# Altium schematic sheet outputs.SchDoc
size A4
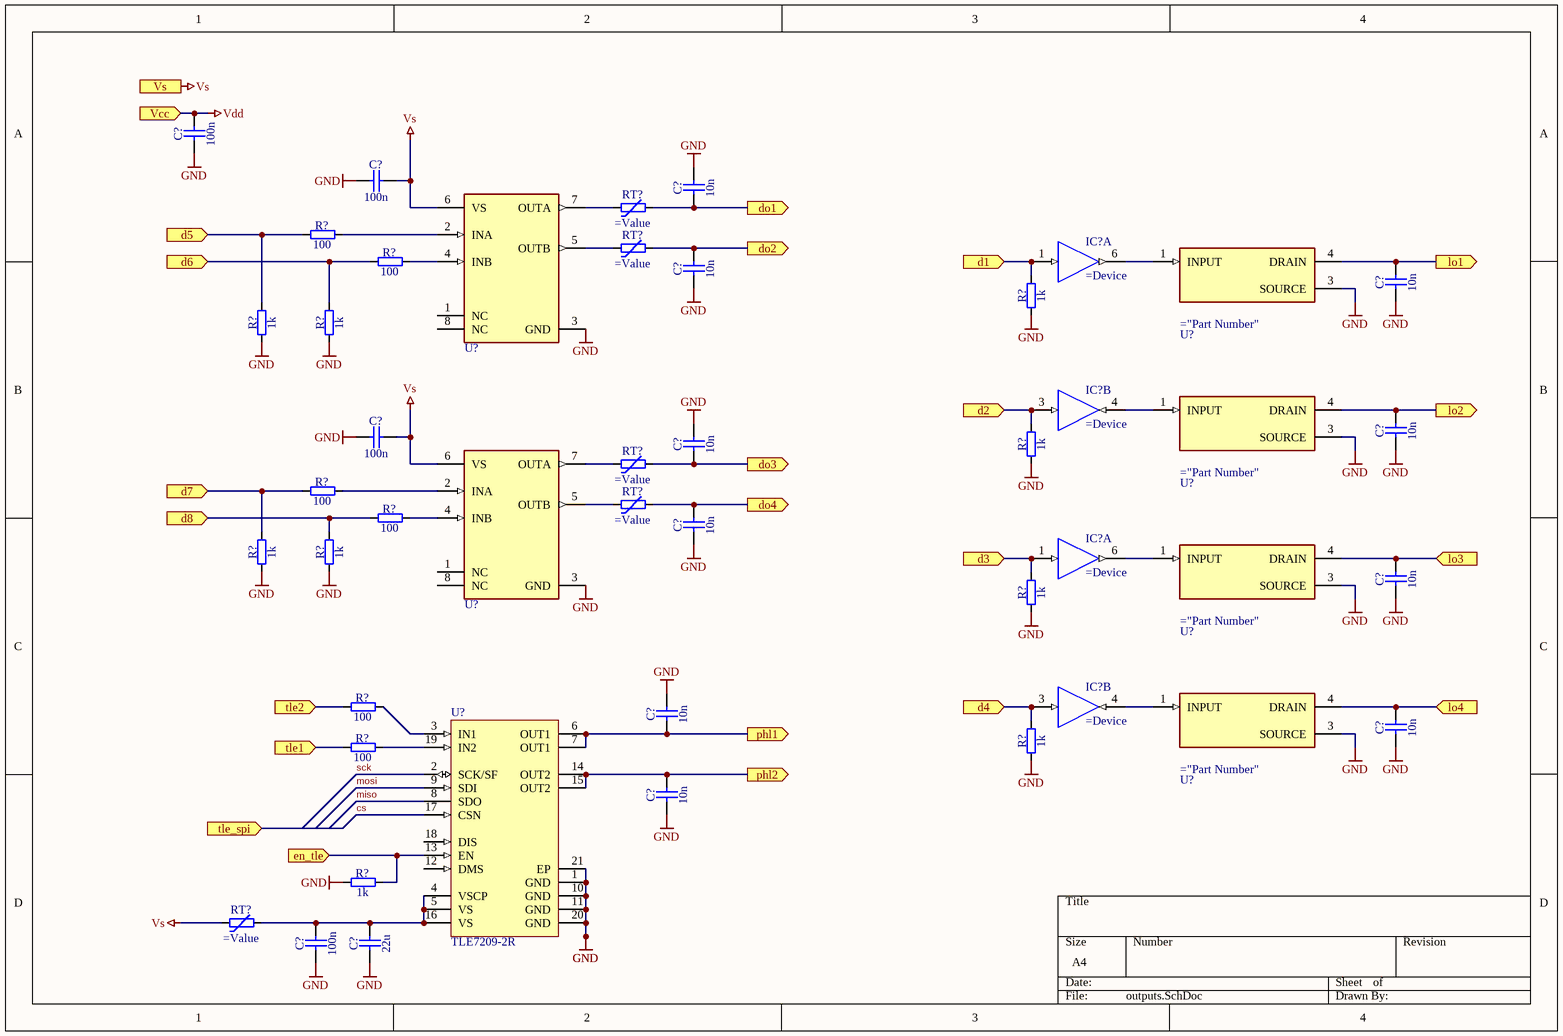
[diagram p0: outputs.SchDoc]

## Parts
(Parts that share a designator on the sheet are numbered #1, #2 ... from top to bottom, then left to right.)
C?#1  100n
C?#2  100n
C?#3  10n
C?#4  10n
C?#5  10n
C?#6  100n
C?#7  10n
C?#8  10n
C?#9  10n
C?#10  10n
C?#11  10n
C?#12  10n
C?#13  10n
C?#14  100n
C?#15  22u
IC?#1  (no value)  (part A of 2)
IC?#2  (no value)  (part B of 2)
IC?#3  (no value)  (part A of 2)
IC?#4  (no value)  (part B of 2)
R?#1  100
R?#2  100
R?#3  1k
R?#4  1k
R?#5  1k
R?#6  1k
R?#7  100
R?#8  100
R?#9  1k
R?#10  1k
R?#11  1k
R?#12  100
R?#13  100
R?#14  1k
R?#15  1k
RT?#1  (no value)
RT?#2  (no value)
RT?#3  (no value)
RT?#4  (no value)
RT?#5  (no value)
U?#1  IR4427STRPBF  (value not drawn)
U?#2  VND7NV04TR-E  (value not drawn)
U?#3  VND7NV04TR-E  (value not drawn)
U?#4  IR4427STRPBF  (value not drawn)
U?#5  VND7NV04TR-E  (value not drawn)
U?#6  VND7NV04TR-E  (value not drawn)
U?#7  TLE7209-2R  [INF-PG-DSO-20-37_M]

## Ports
d1 (in), d2 (in), d3 (in), d4 (in), d5 (in), d6 (in), d7 (in), d8 (in), do1 (out), do2 (out), do3 (out), do4 (out), en_tle (in), lo1 (out), lo2 (out), lo3 (in), lo4 (in), phl1 (out), phl2 (out), tle1 (in), tle2 (in), tle_spi (in), Vcc (in), Vs (in)

## Nets
GND: C?#1.1 C?#2.1 C?#3.2 C?#4.1 C?#5.1 C?#6.1 C?#7.1 C?#8.2 C?#9.1 C?#10.1 C?#11.2 C?#12.1 C?#13.1 C?#14.1 C?#15.1 IC?#1.2(GND) IC?#2.2(GND) IC?#3.2(GND) IC?#4.2(GND) R?#3.1 R?#4.1 R?#5.1 R?#6.1 R?#9.1 R?#10.1 R?#11.1 R?#14.1 R?#15.1 U?#1.3(GND) U?#2.3(SOURCE) U?#3.3(SOURCE) U?#4.3(GND) U?#5.3(SOURCE) U?#6.3(SOURCE) U?#7.1(GND) U?#7.10(GND) U?#7.11(GND) U?#7.20(GND) U?#7.21(EP)
Vdd: C?#1.2 IC?#1.5(Vdd) IC?#2.5(Vdd) IC?#3.5(Vdd) IC?#4.5(Vdd) ; port Vcc
Vs: C?#2.2 C?#6.2 RT?#5.1 U?#1.6(VS) U?#4.6(VS) ; port Vs
cs: U?#7.17(CSN)
d1: IC?#1.1(IN) R?#3.2 ; port d1
d2: IC?#2.3(IN) R?#6.2 ; port d2
d3: IC?#3.1(IN) R?#11.2 ; port d3
d4: IC?#4.3(IN) R?#14.2 ; port d4
d5: R?#1.1 R?#4.2 ; port d5
d6: R?#2.1 R?#5.2 ; port d6
d7: R?#7.1 R?#9.2 ; port d7
d8: R?#8.1 R?#10.2 ; port d8
do1: C?#3.1 RT?#1.2 ; port do1
do2: C?#4.2 RT?#2.2 ; port do2
do3: C?#8.1 RT?#3.2 ; port do3
do4: C?#9.2 RT?#4.2 ; port do4
en_tle: R?#15.2 U?#7.13(EN) ; port en_tle
lo1: C?#5.2 U?#2.4(DRAIN) ; port lo1
lo2: C?#7.2 U?#3.4(DRAIN) ; port lo2
lo3: C?#10.2 U?#5.4(DRAIN) ; port lo3
lo4: C?#12.2 U?#6.4(DRAIN) ; port lo4
miso: U?#7.8(SDO)
mosi: U?#7.9(SDI)
phl1: C?#11.1 U?#7.6(OUT1) U?#7.7(OUT1) ; port phl1
phl2: C?#13.2 U?#7.14(OUT2) U?#7.15(OUT2) ; port phl2
sck: U?#7.2(SCK/SF)
tle1: R?#13.1 ; port tle1
tle2: R?#12.1 ; port tle2
NetC?#14_2: C?#14.2 C?#15.2 RT?#5.2 U?#7.4(VSCP) U?#7.5(VS) U?#7.16(VS)
NetIC?#1_6: IC?#1.6(OUT) U?#2.1(INPUT)
NetIC?#2_4: IC?#2.4(OUT) U?#3.1(INPUT)
NetIC?#3_6: IC?#3.6(OUT) U?#5.1(INPUT)
NetIC?#4_4: IC?#4.4(OUT) U?#6.1(INPUT)
NetR?#1_2: R?#1.2 U?#1.2(INA)
NetR?#2_2: R?#2.2 U?#1.4(INB)
NetR?#7_2: R?#7.2 U?#4.2(INA)
NetR?#8_2: R?#8.2 U?#4.4(INB)
NetR?#12_2: R?#12.2 U?#7.3(IN1)
NetR?#13_2: R?#13.2 U?#7.19(IN2)
NetRT?#1_1: RT?#1.1 U?#1.7(OUTA)
NetRT?#2_1: RT?#2.1 U?#1.5(OUTB)
NetRT?#3_1: RT?#3.1 U?#4.7(OUTA)
NetRT?#4_1: RT?#4.1 U?#4.5(OUTB)

Not connected (* = marked no-connect by the designer): U?#1 1(NC) 8(NC); U?#4 1(NC) 8(NC); U?#7 12(DMS) 18(DIS)

## Library data of the parts
C?#1-C?#15 = Capacitor - non polarized: Non-polarised capacitor
  C?#1 C?#2 C?#6 C?#14: Value: 100n
  C?#3-C?#5 C?#7-C?#13: Value: 10n
  C?#15: Value: 22u
IC?#1-IC?#4 = 742G17: Dual Schmitt-Trigger Buffer
R?#1-R?#15 = Resistor
  R?#1 R?#2 R?#7 R?#8 R?#12 R?#13: Value: 100
  R?#3-R?#6 R?#9-R?#11 R?#14 R?#15: Value: 1k
RT?#1-RT?#5 = Thermistor PTC: Thermistor NTC (Positive Temperature Coefficient)
U?#7 = TLE7209-2R: 7 A H-Bridge for DC-Motor Applications, 5 to 28 V, 150 mOhm RDS(on), PG-DSO-20-37, Reel, Green; Manufacturer: Infineon; Operating Range: 5 to 28 V; RthJC (max): 1.5 K/W; Green: TRUE; Current Limit (min.): 5.5 A; Quiescent Current (max.): 20 mA; ComponentLink1Description: Manufacturer URL; ComponentLink2Description: Datasheet; RDS (on) (typ./switch): 150 mOhm; DatasheetVersion: Rev. 1.5; ComponentLink3URL: http://www.infineon.com/cms/packages/SMD_-_Surface_Mounted_Devices/P-PG-DSO/P-PG-DSO-20-10x_-12x_-13x_-16x_-33x_-34x_-37x_-48x_-50.html?__locale=en; ComponentLink3Description: Package Specification; ComponentLink1URL: http://www.infineon.com/; ComponentLink2URL: http://www.infineon.com/dgdl/TLE7209-2R-Data+Sheet-Infineon-v15.pdf?folderId=db3a30431b3e89eb011bb632994f065b&fileId=db3a30431f848401011fc76ca8e77a06&sId=db3a30443d67b5ca013d7f7d1d1f2bb3; PackageReference: PG-DSO-20-37; Packing: Reel; Mounting Technology: Surface Mount; Halogen-free: TRUE; PackageDescription: 20-Pin Plastic (Green) Dual Small Outline Package, 15.9 x 11 mm Body, 1.27 mm Pitch; PartNumber: TLE7209-2R